# EAGLE schematic moisture sensor schematic (EAGLE 9.6.2)
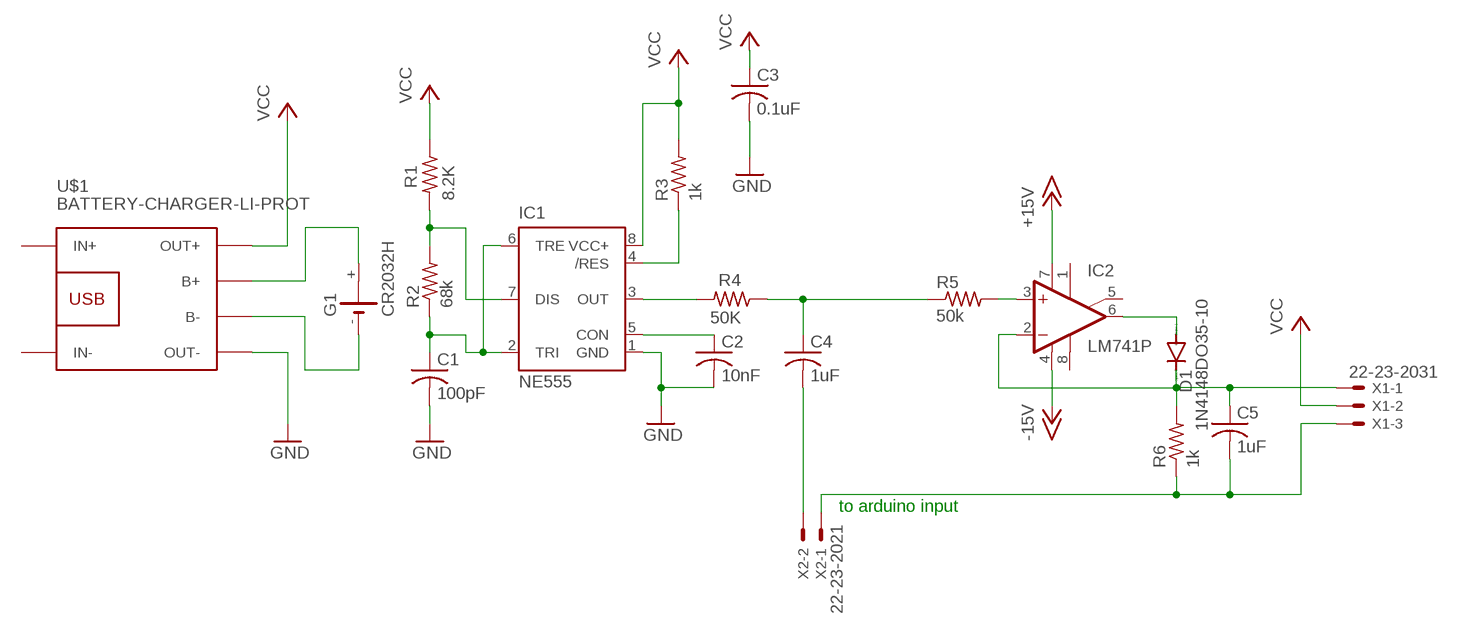
[diagram p0: schematic, sheet 1]

## Parts
C1  100pF  C-USC1206  [C1206]
C2  10nF  C-USC1206  [C1206]
C3  0.1uF  C-USC1206  [C1206]
C4  1uF  C-USC1206  [C1206]
C5  1uF  C-USC1206  [C1206]
D1  1N4148DO35-10  [DO35-10]
G1  CR2032H  [CR2032H]
IC1  NE555  [DIL-08]
IC2  LM741P  [DIL08]
R1  8.2K  R-US_R0603  [R0603]
R2  68k  R-US_R0603  [R0603]
R3  1k  R-US_R0603  [R0603]
R4  50K  R-US_R0603  [R0603]
R5  50k  R-US_R0603  [R0603]
R6  1k  R-US_R0603  [R0603]
U$1  BATTERY-CHARGER-LI-PROT  [BATTERY-CHARGER-LI-PROT]
X1  22-23-2031  [22-23-2031]
X2  22-23-2021  [22-23-2021]

## Nets
+15V: IC2.7(V+)
-15V: IC2.4(V-)
GND: C1.2 C2.2 C3.2 IC1.1(GND) U$1.OUT-
N$1: C1.1 IC1.2(TRI) IC1.6(TRE) R2.1
N$2: IC1.7(DIS) R1.2 R2.2
N$3: IC1.4(/RES) R3.1
N$4: C2.1 IC1.5(CON)
N$5: IC1.3(OUT) R4.2
N$6: C4.1 R4.1 R5.1
N$7: C4.2 X2.2
N$8: IC2.3(+IN) R5.2
N$9: C5.1 D1.C IC2.2(-IN) R6.2 X1.1
N$10: D1.A IC2.6(OUT)
N$11: C5.2 R6.1 X1.3 X2.1
N$12: G1.- U$1.B-
N$14: G1.+ U$1.B+
VCC: C3.1 IC1.8(VCC+) R1.1 R3.2 U$1.OUT+ X1.2
Unconnected: G1.+@1(+) IC2.1(ON1) IC2.5(ON2) IC2.8(OPT) U$1.IN+ U$1.IN-

## Notes on the sheet
- to arduino input

## Library data of the parts
C1-C5 = rcl:C-US: CAPACITOR, American symbol; SPICEPREFIX: C
D1 = diode:1N4148: DIODE high speed (Philips); SPICEPREFIX: D
G1 = battery:CR2032H: LI BATTERY Varta
IC1 = st-microelectronics:NE555: General purpose bipolar Timer; MF: Arrow Electronics; MPN: NE555N; OC_FARNELL: 1467742; OC_NEWARK: 89K1486; SPICEPREFIX: X
IC2 = linear:*741: OP AMP; SPICEPREFIX: X
R1-R6 = rcl:R-US_: RESISTOR, American symbol; SPICEPREFIX: R
U$1 = diy-modules:BATTERY-CHARGER-LI-PROT: Lithium Battery 5V Charger with protection circuit More details available here: http://www.instructables.com/id/DIY-Lithium-ion-Battery-Charger/step4/TP4056-based-lithium-ion-battery-charger-module/ Click here to find device on ebay.com <http://www.ebay.com/sch/tp4056+charger+usb+protection>; SPICEPREFIX: X
X1 = con-molex:22-23-2031: .100" (2.54mm) Center Header - 3 Pin; MF: MOLEX; MPN: 22-23-2031; OC_FARNELL: 1462950; OC_NEWARK: 30C0862; SPICEPREFIX: X
X2 = con-molex:22-23-2021: .100" (2.54mm) Center Header - 2 Pin; MF: MOLEX; MPN: 22-23-2021; OC_FARNELL: 1462926; OC_NEWARK: 25C3832; SPICEPREFIX: X